# EAGLE design EVMS3_Monitor (EAGLE 9.5.1)
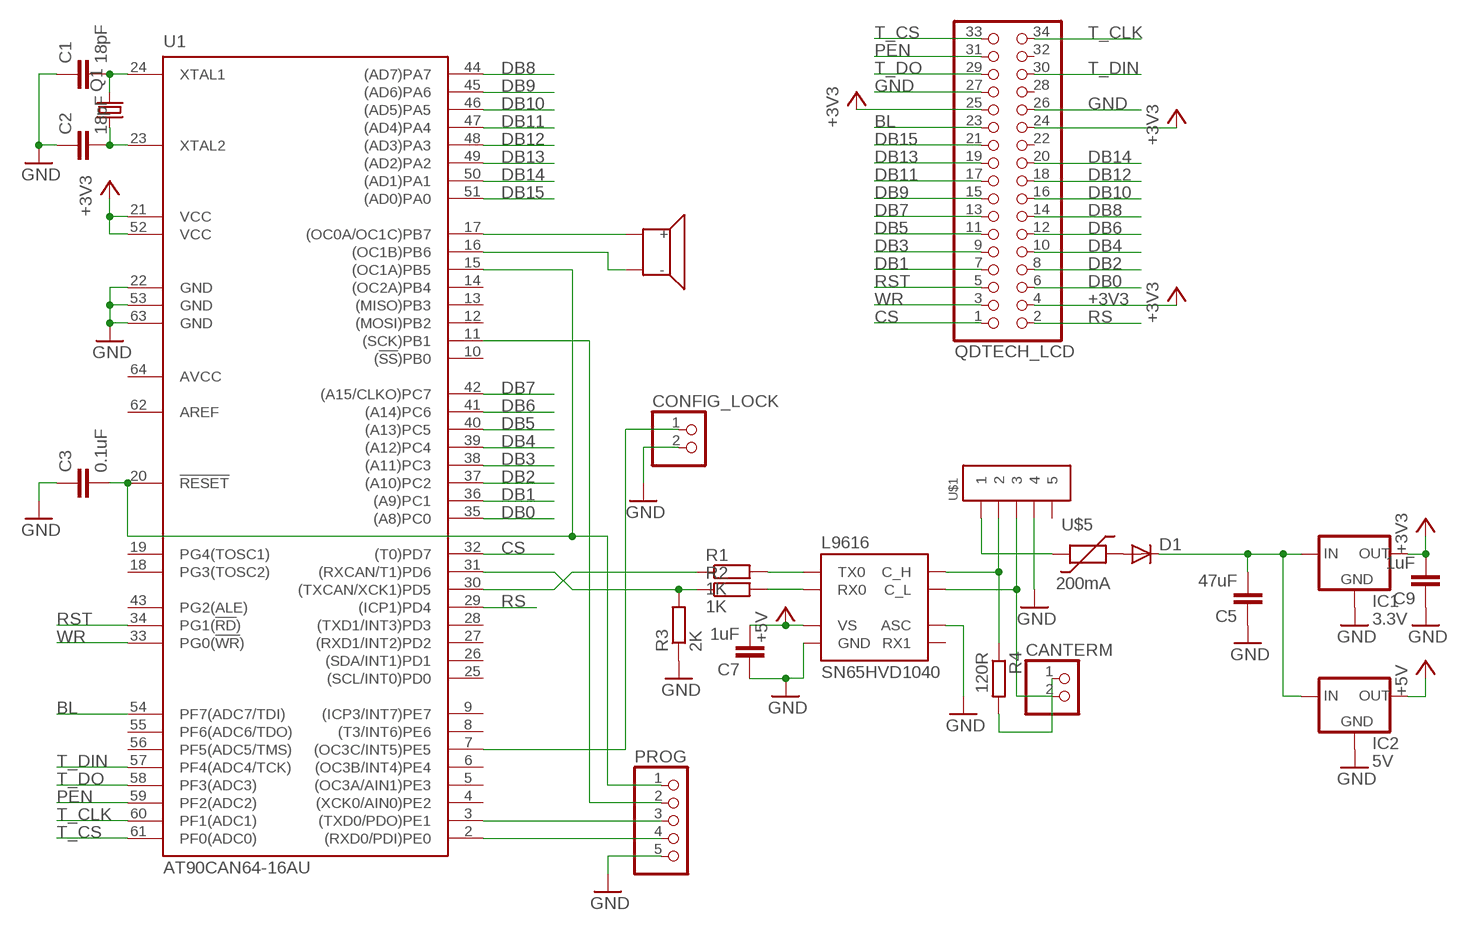
[diagram p0: schematic, sheet 1]

## Parts
C1  18pF  C-EUC0805  [C0805]
C2  18pF  C-EUC0805  [C0805]
C3  0.1uF  C-EUC1206  [C1206]
C5  47uF  C-EUC1206  [C1206]
C7  1uF  C-EUC1206  [C1206]
C9  1uF  C-EUC1206  [C1206]
CANTERM  PINHD-1X2  [1X02]
CONFIG_LOCK  PINHD-1X2  [1X02]
D1  DIODE-SOD123  [SOD123]
IC1  3.3V  78LXXSOT89  [SOT89R]
IC2  5V  78LXXSOT89  [SOT89R]
PROG  PINHD-1X5  [1X05]
Q1  CRYSTALCTS406  [CTS406]
QDTECH_LCD  PINHD-2X17  [2X17]
R1  1K  R-EU_R1206  [R1206]
R2  1K  R-EU_R1206  [R1206]
R3  2K  R-EU_R1206  [R1206]
R4  120R  R-EU_R1206  [R1206]
SN65HVD1040  L9616  [SOIC8]
U1  AT90CAN64-16AU  [TQFP64-0.8MM]
U$1  MOLEX-39502-1005VERT  [MOLEX-39501-1005]
U$5  200mA  1206_POLYSWITCH  [1206]
U$6  MURATA_PIEZO  [PKLCS1212E_PIEZO]

## Nets
+3V3: C9.2 IC1.2(OUT) QDTECH_LCD.4 QDTECH_LCD.24 QDTECH_LCD.25 U1.21(VCC) U1.52(VCC)
+5V: C7.2 IC2.2(OUT) SN65HVD1040.P$3(VS)
BL: QDTECH_LCD.23 U1.54(PF7(ADC7/TDI))
BUZZER: U1.17((OC0A/OC1C)PB7) U$6.1(+)
CS: QDTECH_LCD.1 U1.32((T0)PD7)
DB0: QDTECH_LCD.6 U1.35((A8)PC0)
DB1: QDTECH_LCD.7 U1.36((A9)PC1)
DB2: QDTECH_LCD.8 U1.37((A10)PC2)
DB3: QDTECH_LCD.9 U1.38((A11)PC3)
DB4: QDTECH_LCD.10 U1.39((A12)PC4)
DB5: QDTECH_LCD.11 U1.40((A13)PC5)
DB6: QDTECH_LCD.12 U1.41((A14)PC6)
DB7: QDTECH_LCD.13 U1.42((A15/CLKO)PC7)
DB8: QDTECH_LCD.14 U1.44((AD7)PA7)
DB9: QDTECH_LCD.15 U1.45((AD6)PA6)
DB10: QDTECH_LCD.16 U1.46((AD5)PA5)
DB11: QDTECH_LCD.17 U1.47((AD4)PA4)
DB12: QDTECH_LCD.18 U1.48((AD3)PA3)
DB13: QDTECH_LCD.19 U1.49((AD2)PA2)
DB14: QDTECH_LCD.20 U1.50((AD1)PA1)
DB15: QDTECH_LCD.21 U1.51((AD0)PA0)
GND: C1.1 C2.1 C3.1 C5.1 C7.1 C9.1 CONFIG_LOCK.2 IC1.4(GND) IC2.4(GND) PROG.5 QDTECH_LCD.26 QDTECH_LCD.27 R3.1 SN65HVD1040.P$2(GND) SN65HVD1040.P$8(ASC) U1.22(GND) U1.53(GND) U1.63(GND) U$1.4
N$1: C3.2 PROG.1 U1.15((OC1A)PB5) U1.20(!RESET)
N$3: C1.2 Q1.3 U1.24(XTAL1)
N$4: C2.2 Q1.1 U1.23(XTAL2)
N$5: PROG.4 U1.2((RXD0/PDI)PE0)
N$6: PROG.3 U1.3((TXD0/PDO)PE1)
N$7: PROG.2 U1.11((SCK)PB1)
N$8: R1.1 U1.30((TXCAN/XCK1)PD5)
N$9: C5.2 D1.C IC1.1(IN) IC2.1(IN)
N$10: R2.1 R3.2 U1.31((RXCAN/T1)PD6)
N$11: R1.2 SN65HVD1040.P$1(TX0)
N$12: R2.2 SN65HVD1040.P$4(RX0)
N$13: CONFIG_LOCK.1 U1.7((OC3C/INT5)PE5)
N$14: R4.1 SN65HVD1040.P$7(C_H) U$1.2
N$15: CANTERM.2 SN65HVD1040.P$6(C_L) U$1.3
N$16: CANTERM.1 R4.2
N$18: U1.16((OC1B)PB6) U$6.2(-)
N$20: D1.A U$5.P$2
N$22: U$1.1 U$5.P$1
PEN: QDTECH_LCD.31 U1.59(PF2(ADC2))
RS: QDTECH_LCD.2 U1.29((ICP1)PD4)
RST: QDTECH_LCD.5 U1.34(PG1(!RD!))
T_CLK: QDTECH_LCD.34 U1.60(PF1(ADC1))
T_CS: QDTECH_LCD.33 U1.61(PF0(ADC0))
T_DIN: QDTECH_LCD.30 U1.57(PF4(ADC4/TCK))
T_DO: QDTECH_LCD.29 U1.58(PF3(ADC3))
WR: QDTECH_LCD.3 U1.33(PG0(!WR!))
Unconnected: QDTECH_LCD.22 QDTECH_LCD.28 QDTECH_LCD.32 SN65HVD1040.P$5(RX1) U1.4((XCK0/AIN0)PE2) U1.5((OC3A/AIN1)PE3) U1.6((OC3B/INT4)PE4) U1.8((T3/INT6)PE6) U1.9((ICP3/INT7)PE7) U1.10((!SS!)PB0) U1.12((MOSI)PB2) U1.13((MISO)PB3) U1.14((OC2A)PB4) U1.18(PG3(TOSC2)) U1.19(PG4(TOSC1)) U1.25((SCL/INT0)PD0) U1.26((SDA/INT1)PD1) U1.27((RXD1/INT2)PD2) U1.28((TXD1/INT3)PD3) U1.43(PG2(ALE)) U1.55(PF6(ADC6/TDO)) U1.56(PF5(ADC5/TMS)) U1.62(AREF) U$1.5

## Power pins joined to a net without a drawn wire
AVCC: U1.64(AVCC)

## Library data of the parts
C1-C3 C5 C7 C9 = resistor:C-EU: CAPACITOR, European symbol
CANTERM CONFIG_LOCK = pinhead:PINHD-1X2: PIN HEADER
D1 = diode:DIODE-: DIODE
IC1 IC2 = v-reg:78LXX: VOLTAGE REGULATOR
PROG = pinhead:PINHD-1X5: PIN HEADER
Q1 = crystal:CRYSTAL: CRYSTAL
QDTECH_LCD = pinhead:PINHD-2X17: PIN HEADER
R1-R4 = resistor:R-EU_: RESISTOR, European symbol
SN65HVD1040 = Ians parts:L9616
U1 = at90can32_64_128_v2:AT90CAN*: ATMEL AVR AT90CAN32-..A. / 64-..A. / 128-..A., TQFP64 with 0.8mm pad spacing (Atmel Package Code 'A2 64': 64-Lead, Thin 1.0 mm / 0.03937 in. Plastic Gull Wing Quad Flat Package) Ordering Code = Product Marking / Speed (MHz) / Power Supply (V) / Operation Range AT90CANx-16AI / 16 / 2.7 .. 5.5 / Industrial (-40 .. +85)°C AT90CANx-16AU / 16 / 2.7 .. 5.5 / Industrial Green (-40 .. +85)°C x = 32 / 64 / 128 (KB of ISP Flash Memory) Author: Dipl.-Ing. FH Rainer Bayer HHN Hochschule Heilbronn, rainer.bayer@hs-heilbronn.de Ingenieurbüro ing-rb, mail@ing-rb.de
U$1 = Ians parts:MOLEX-39502-1005
U$5 = Ians parts:1206_POLYSWITCH
U$6 = Ians parts:MURATA_PIEZO

## Board
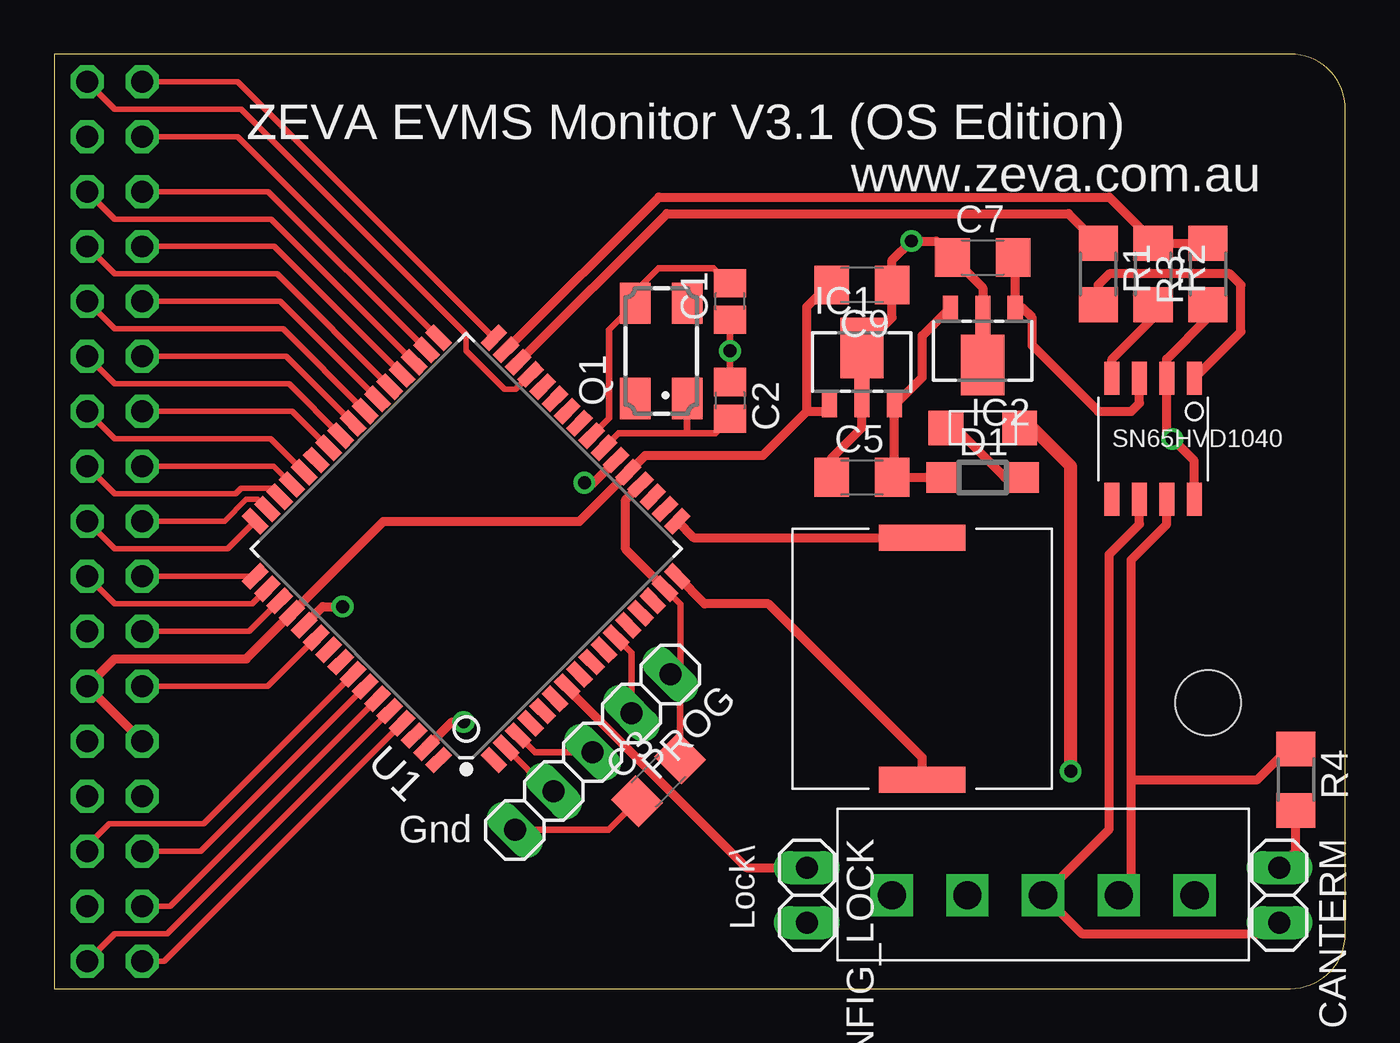
[diagram p1: board, top side]
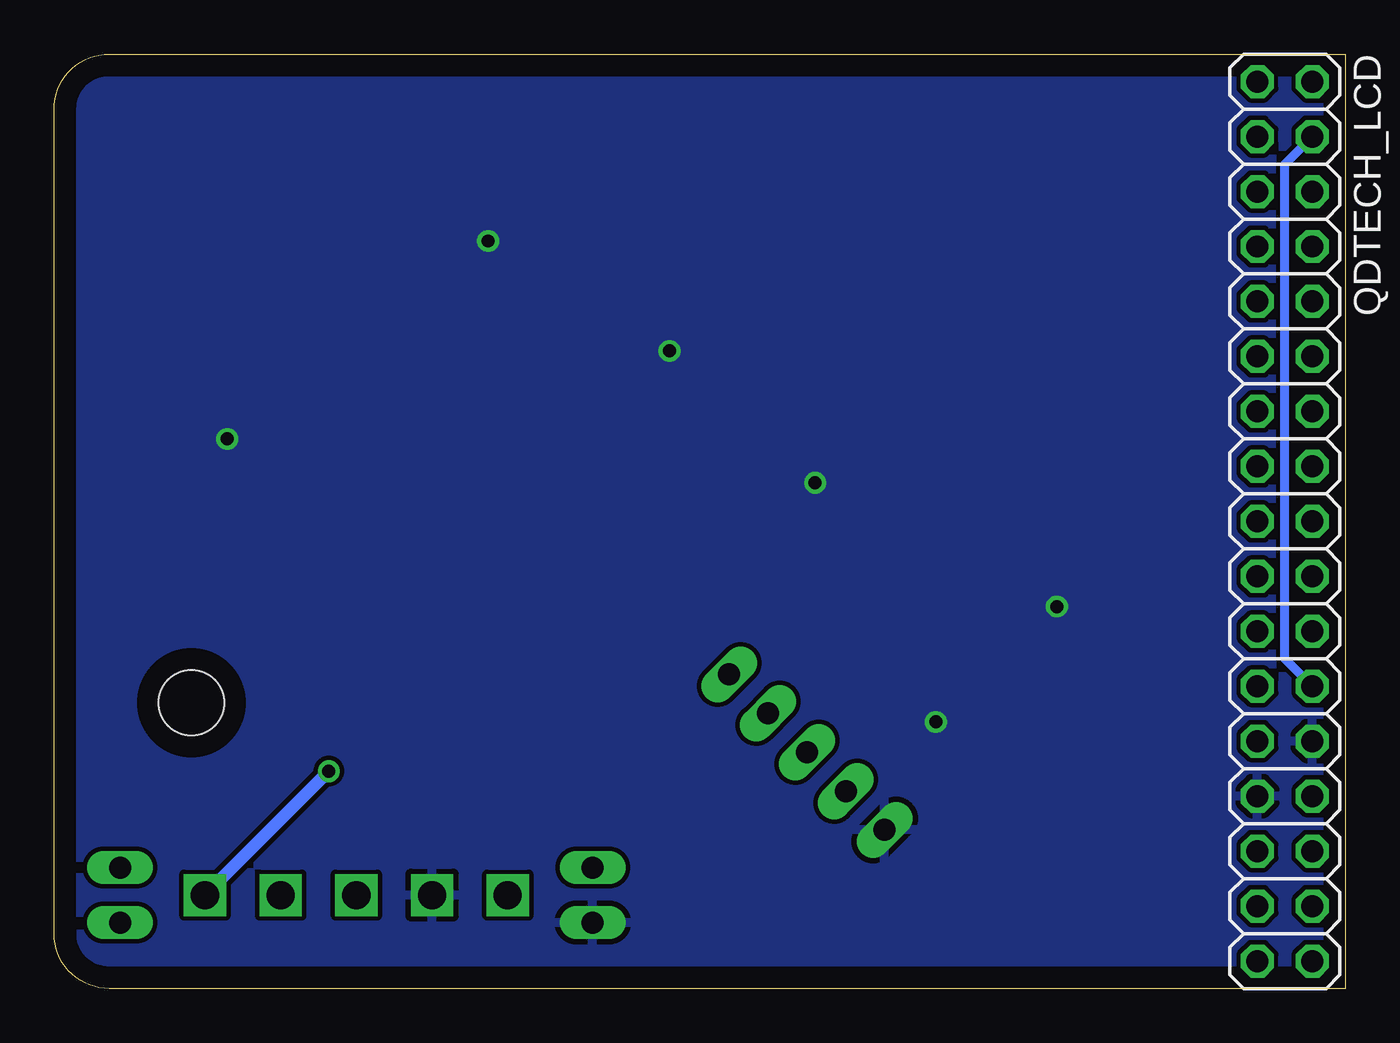
[diagram p2: board, bottom side, seen from below]

Size 59.69 x 43.18 mm. Coordinates in mm from the lower left corner, seen from the top.
Outline: 0,43.18 0,0 57.15,0 arc90 59.69,2.54 59.69,40.64 arc90 57.15,43.18 0,43.18
Copper layers (1*16): Top 0.035mm / dielectric 1.5mm / Bottom 0.035mm
Design rules "default *": minimum track width 10mil, minimum drill 10mil, track to track 8mil, track to pad 8mil, pad to pad 8mil, via to via 8mil, smd to smd 8mil, copper to edge 40mil, drill to drill 8mil, minimum pad ring 10mil, minimum via ring 8mil, stop-mask expansion 4mil, vias tented up to drill 0mil, thermal gap 10mil
Holes 3 mm at 53.34,13.21

### Footprints (pad centres in the part's own frame; a part is rotated, then mirrored left to right if it is on the bottom)
C0805 = smd 1.3 x 1.5: 1 -0.85,0; 2 0.85,0
C1206 = smd 1.6 x 1.8: 1 -1.4,0; 2 1.4,0
1X02 = drill 1.016 long: 1 -1.27,0; 2 1.27,0
SOD123 = smd 1.4 x 1.4: A 1.9,0; C -1.9,0
SOT89R = smd 0.7 x 1.1: 1 1.5,-1.75; 2 -1.5,-1.75 | smd 0.7 x 1.8: 3 0,-1.4 | smd 2 x 2.8: 4 0,0.9
1X05 = drill 1.016 long: 1 -5.08,0; 2 -2.54,0; 3 0,0; 4 2.54,0; 5 5.08,0
CTS406 = smd 1.9 x 1.4: 1 -2.2,-1.2; 2 2.2,-1.2; 3 2.2,1.2; 4 -2.2,1.2
2X17 = drill 1.016 octagon: 1 -20.32,-1.27; 2 -20.32,1.27; 3 -17.78,-1.27; 4 -17.78,1.27; 5 -15.24,-1.27; 6 -15.24,1.27; 7 -12.7,-1.27; 8 -12.7,1.27; 9 -10.16,-1.27; 10 -10.16,1.27; 11 -7.62,-1.27; 12 -7.62,1.27; 13 -5.08,-1.27; 14 -5.08,1.27; 15 -2.54,-1.27; 16 -2.54,1.27; 17 0,-1.27; 18 0,1.27; 19 2.54,-1.27; 20 2.54,1.27; 21 5.08,-1.27; 22 5.08,1.27; 23 7.62,-1.27; 24 7.62,1.27; 25 10.16,-1.27; 26 10.16,1.27; 27 12.7,-1.27; 28 12.7,1.27; 29 15.24,-1.27; 30 15.24,1.27; 31 17.78,-1.27; 32 17.78,1.27; 33 20.32,-1.27; 34 20.32,1.27
R1206 = smd 1.6 x 1.803: 1 -1.422,0; 2 1.422,0
SOIC8 = smd 1.524 x 0.711: P$1 -2.794,1.905; P$2 -2.794,0.635; P$3 -2.794,-0.635; P$4 -2.794,-1.905; P$5 2.794,-1.905; P$6 2.794,-0.635; P$7 2.794,0.635; P$8 2.794,1.905
TQFP64-0.8MM = smd 1.194 x 0.559: 1 -7.8,6; 2 -7.8,5.2; 3 -7.8,4.4; 4 -7.8,3.6; 5 -7.8,2.8; 6 -7.8,2; 7 -7.8,1.2; 8 -7.8,0.4; 9 -7.8,-0.4; 10 -7.8,-1.2; 11 -7.8,-2; 12 -7.8,-2.8; 13 -7.8,-3.6; 14 -7.8,-4.4; 15 -7.8,-5.2; 16 -7.8,-6; 33 7.8,-6; 34 7.8,-5.2; 35 7.8,-4.4; 36 7.8,-3.6; 37 7.8,-2.8; 38 7.8,-2; 39 7.8,-1.2; 40 7.8,-0.4; 41 7.8,0.4; 42 7.8,1.2; 43 7.8,2; 44 7.8,2.8; 45 7.8,3.6; 46 7.8,4.4; 47 7.8,5.2; 48 7.8,6 | smd 0.559 x 1.194: 17 -6,-7.8; 18 -5.2,-7.8; 19 -4.4,-7.8; 20 -3.6,-7.8; 21 -2.8,-7.8; 22 -2,-7.8; 23 -1.2,-7.8; 24 -0.4,-7.8; 25 0.4,-7.8; 26 1.2,-7.8; 27 2,-7.8; 28 2.8,-7.8; 29 3.6,-7.8; 30 4.4,-7.8; 31 5.2,-7.8; 32 6,-7.8; 49 6,7.8; 50 5.2,7.8; 51 4.4,7.8; 52 3.6,7.8; 53 2.8,7.8; 54 2,7.8; 55 1.2,7.8; 56 0.4,7.8; 57 -0.4,7.8; 58 -1.2,7.8; 59 -2,7.8; 60 -2.8,7.8; 61 -3.6,7.8; 62 -4.4,7.8; 63 -5.2,7.8; 64 -6,7.8
MOLEX-39501-1005 = drill 1.3 square: 1 -7,0; 2 -3.5,0; 3 0,0; 4 3.5,0; 5 7,0
1206 = smd 1.6 x 1.6: P$1 -1.7,0; P$2 1.7,0
PKLCS1212E_PIEZO = smd 1.2 x 4: 1 -5.6,0; 2 5.6,0

### Placement (x,y rotation side)
C1  31.24,31.75 90 top
C2  31.24,27.18 270 top
C3  27.94,9.65 45 top
C5  37.34,23.62 0 top
C7  42.93,33.78 0 top
C9  37.34,32.51 180 top
CANTERM  56.64,4.32 270 top
CONFIG_LOCK  34.8,4.32 270 top
D1  42.93,23.62 0 top
IC1  37.34,28.7 0 top
IC2  42.93,29.72 180 top
PROG  24.89,10.92 225 top
Q1  28.07,29.46 90 top
QDTECH_LCD  2.79,21.59 270 bottom
R1  48.26,33.02 270 top
R2  50.8,33.02 270 top
R3  53.34,33.02 90 top
R4  57.4,9.65 270 top
SN65HVD1040  50.8,25.4 270 top
U1  19.05,20.32 135 top
U$1  45.72,4.32 180 top
U$5  42.93,25.91 180 top
U$6  40.13,15.24 270 top

### Tracks (layer width: path | path; a pad name or v marks a point on that pad's centre or on a via)
+3V3
  Top 0.406: QDTECH_LCD.25 QDTECH_LCD.24 2.79,15.24 8.88,15.24 U1.52 15.23,21.59 24.28,21.59 U1.21 27.33,24.64 32.77,24.64 34.8,26.67 | 34.8,26.67 34.8,31.5 35.81,32.51 C9.2 | IC1.2 35.56,26.67 34.8,26.67
  Bottom 0.406: QDTECH_LCD.4 2.79,38.1 2.79,15.24 QDTECH_LCD.24
+5V
  Top 0.406: C7.2 44.43,33.68 IC2.2 44.73,31.47 45.21,30.99 45.21,29.72 48.26,26.67 49.78,26.67 50.16,27.05 SN65HVD1040.P$3
BL
  Top 0.254: U1.54 9.87,13.97 QDTECH_LCD.23
BUZZER
  Top 0.406: U1.17 29.56,20.84 U$6.1
CS
  Top 0.254: QDTECH_LCD.1 8.49,41.91 U1.32
DB0
  Top 0.254: QDTECH_LCD.6 2.79,35.56 10.03,35.56 U1.35
DB1
  Top 0.254: U1.36 10.17,34.29 QDTECH_LCD.7
DB2
  Top 0.254: QDTECH_LCD.8 2.79,33.02 10.31,33.02 U1.37
DB3
  Top 0.254: U1.38 10.45,31.75 QDTECH_LCD.9
DB4
  Top 0.254: QDTECH_LCD.10 2.79,30.48 10.59,30.48 U1.39
DB5
  Top 0.254: U1.40 10.73,29.21 QDTECH_LCD.11
DB6
  Top 0.254: QDTECH_LCD.12 2.79,27.94 10.86,27.94 U1.41
DB7
  Top 0.254: U1.42 11,26.67 QDTECH_LCD.13
DB8
  Top 0.254: QDTECH_LCD.14 2.79,25.4 10.01,25.4 U1.44
DB9
  Top 0.254: U1.45 10.15,24.13 QDTECH_LCD.15
DB10
  Top 0.254: QDTECH_LCD.16 2.79,22.86 8.38,22.86 8.64,23.11 10.03,23.11 U1.46
DB11
  Top 0.254: U1.47 9.41,22.61 8.89,22.61 7.87,21.59 QDTECH_LCD.17
DB12
  Top 0.254: QDTECH_LCD.18 2.79,20.32 8.02,20.32 U1.48
DB13
  Top 0.254: QDTECH_LCD.19 U1.49
DB14
  Top 0.254: U1.50 9.16,17.78 2.79,17.78 QDTECH_LCD.20
DB15
  Top 0.254: U1.51 9.02,16.51 QDTECH_LCD.21
GND  (via drill 0.6)
  Top 0.305: C3.1 25.62,7.33 PROG.5 | C1.1 v31.24,29.46 C2.1
  Top 0.406: U1.22 24.93,23.37 v24.51,23.37 | U1.53 12.42,17.65 v13.34,17.65 | v18.92,12.32 18.4,12.32 U1.63 | IC2.4 42.93,32.38 C7.1 40.76,34.54 v39.62,34.54 38.74,33.66 C9.1 38.74,31 IC1.4 37.34,25.91 35.94,24.51 C5.1 | R3.1 53.34,30.99 51.44,29.08 SN65HVD1040.P$2 51.44,25.65 v51.69,25.4 52.7,24.38 SN65HVD1040.P$8
  pour Bottom: -1.27,-1.27 -1.27,44.45 60.96,44.45 60.96,-1.27
N$1
  Top 0.305: C3.2 28.93,14.07 PROG.1 28.96,14.99 28.96,17.77 U1.15
  Top 0.406: U1.20 26.42,22.59 26.42,20.31 U1.15
N$3
  Top 0.305: U1.24 25.65,26.36 25.65,30.45 Q1.3 26.92,31.72 26.92,32.26 27.94,33.27 30.48,33.27 31.15,32.6 C1.2
N$4
  Top 0.305: U1.23 26.08,25.65 27.94,25.65 29.27,25.65 | 29.27,25.65 30.57,25.65 C2.2 | 29.27,25.65 Q1.1
N$5
  Top 0.305: U1.2 22.89,9.13 PROG.4
N$6
  Top 0.305: U1.3 22.23,10.92 PROG.3
N$7
  Top 0.305: U1.11 26.69,15.51 PROG.2
N$8
  Top 0.406: U1.30 28.32,35.81 46.89,35.81 R1.1
N$9
  Top 0.406: IC2.1 40.13,30.17 40.13,28.25 IC1.1 38.84,24.13 | 38.84,24.13 38.84,23.72 C5.2 | D1.C 39.35,23.62 38.84,24.13
N$10
  Top 0.406: R3.2 R2.1 50.8,34.54 48.77,36.58 27.95,36.58 U1.31
N$11
  Top 0.406: R1.2 48.26,32.51 48.77,33.02 54.36,33.02 54.86,32.51 54.86,30.35 SN65HVD1040.P$1
N$12
  Top 0.406: SN65HVD1040.P$4 48.9,29.08 50.8,30.99 R2.2
N$13
  Top 0.406: CONFIG_LOCK.1 32,5.59 23.72,13.88 U1.7
N$14
  Top 0.406: SN65HVD1040.P$7 51.44,21.46 49.78,19.81 49.78,9.65 | 49.78,9.65 49.78,4.88 U$1.2 | R4.1 57.05,11.07 55.63,9.65 49.78,9.65
N$15
  Top 0.406: SN65HVD1040.P$6 50.16,21.46 48.77,20.07 48.77,7.37 U$1.3 47.5,2.54 56.13,2.54 CANTERM.2
N$16
  Top 0.406: CANTERM.1 57.4,6.35 R4.2
N$18
  Top 0.406: U1.16 30.07,17.78 33.02,17.78 40.13,10.67 U$6.2
N$20
  Top 0.406: D1.A 43.94,23.62 41.66,25.91 U$5.P$2
N$22  (via drill 0.6)
  Top 0.61: v46.99,10.05 46.99,24.13 45.21,25.91 U$5.P$1
  Bottom 0.61: U$1.1 v46.99,10.05
PEN
  Top 0.254: U1.59 5.37,3.81 QDTECH_LCD.31
RS
  Top 0.254: U1.29 21.32,27.69 20.83,27.69 19.05,29.46 19.05,30.23 8.64,40.64 2.79,40.64 QDTECH_LCD.2
RST
  Top 0.254: QDTECH_LCD.5 9.89,36.83 U1.34
T_CLK
  Top 0.254: QDTECH_LCD.34 2.79,2.54 5.23,2.54 U1.60
T_CS
  Top 0.254: U1.61 5.09,1.27 QDTECH_LCD.33
T_DIN
  Top 0.254: QDTECH_LCD.30 1.27,6.35 2.54,7.62 6.92,7.62 U1.57
T_DO
  Top 0.254: U1.58 6.78,6.35 QDTECH_LCD.29
WR
  Top 0.254: QDTECH_LCD.3 8.48,39.37 U1.33

### Text on the board
tPlace: ZEVA EVMS Monitor V3.1 (OS Edition) | www.zeva.com.au | Gnd | Lock\